# EAGLE design F2 (EAGLE 9.6.2)
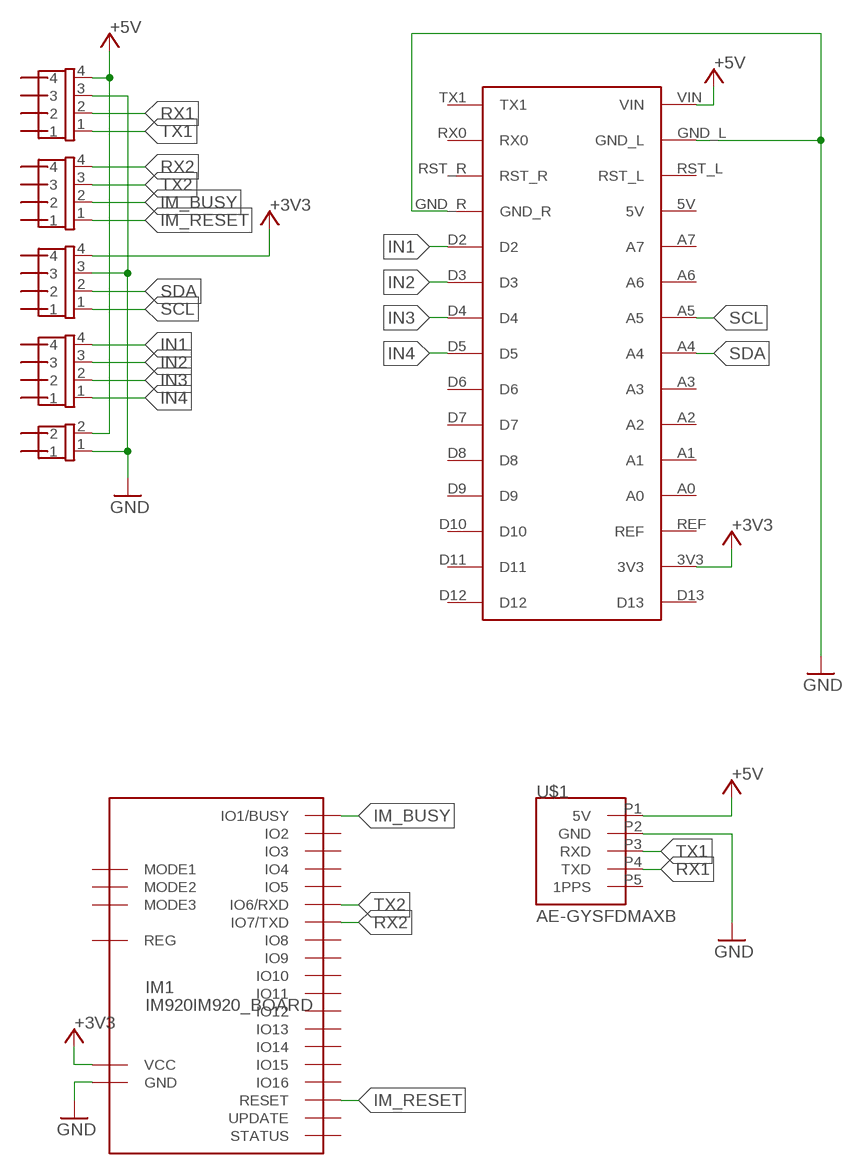
[diagram p0: schematic, sheet 1]

## Parts
ARDUINO_NANO2  ARDUINO_NANO  [ARDUINO_NANO]
CONN1  4PIN  [4PIN]
CONN2  4PIN  [4PIN]
CONN3  4PIN  [4PIN]
CONN4  4PIN  [4PIN]
CONN5  2PIN  [2PIN]
IM1  IM920IM920_BOARD  [IM920_BOARD]
U$1  AE-GYSFDMAXB  [AE-GYSFDMAXB]

## Nets
+3V3: ARDUINO_NANO2.3V3 CONN3.4 IM1.IO23(VCC)
+5V: ARDUINO_NANO2.VIN CONN1.4 CONN5.2 U$1.P1(5V)
GND: ARDUINO_NANO2.GND_L ARDUINO_NANO2.GND_R CONN1.3 CONN3.3 CONN5.1 IM1.IO24(GND) U$1.P2(GND)
IM_BUSY: CONN2.2 IM1.IO1(IO1/BUSY)
IM_RESET: CONN2.1 IM1.IO25(RESET)
IN1: ARDUINO_NANO2.D2 CONN4.4
IN2: ARDUINO_NANO2.D3 CONN4.3
IN3: ARDUINO_NANO2.D4 CONN4.2
IN4: ARDUINO_NANO2.D5 CONN4.1
RX1: CONN1.2 U$1.P4(TXD)
RX2: CONN2.4 IM1.IO7(IO7/TXD)
SCL: ARDUINO_NANO2.A5 CONN3.1
SDA: ARDUINO_NANO2.A4 CONN3.2
TX1: CONN1.1 U$1.P3(RXD)
TX2: CONN2.3 IM1.IO6(IO6/RXD)
Unconnected: ARDUINO_NANO2.5V ARDUINO_NANO2.A0 ARDUINO_NANO2.A1 ARDUINO_NANO2.A2 ARDUINO_NANO2.A3 ARDUINO_NANO2.A6 ARDUINO_NANO2.A7 ARDUINO_NANO2.D6 ARDUINO_NANO2.D7 ARDUINO_NANO2.D8 ARDUINO_NANO2.D9 ARDUINO_NANO2.D10 ARDUINO_NANO2.D11 ARDUINO_NANO2.D12 ARDUINO_NANO2.D13 ARDUINO_NANO2.REF ARDUINO_NANO2.RST_L ARDUINO_NANO2.RST_R ARDUINO_NANO2.RX0 ARDUINO_NANO2.TX1 IM1.IO2 IM1.IO3 IM1.IO4 IM1.IO5 IM1.IO8 IM1.IO9 IM1.IO10 IM1.IO11 IM1.IO12 IM1.IO13 IM1.IO14 IM1.IO15 IM1.IO16 IM1.IO17(MODE1) IM1.IO18(MODE2) IM1.IO19(MODE3) IM1.IO20(UPDATE) IM1.IO21(STATUS) IM1.IO22(REG) U$1.P5(1PPS)

## Library data of the parts
ARDUINO_NANO2 = arduino nano:ARDUINO_NANO
CONN1-CONN4 = 171822 connecter:4PIN
CONN5 = 171822 connecter:2PIN
IM1 = IM920:IM920
U$1 = AE-GYSFDMAXB:AE-GYSFDMAXB

## Board
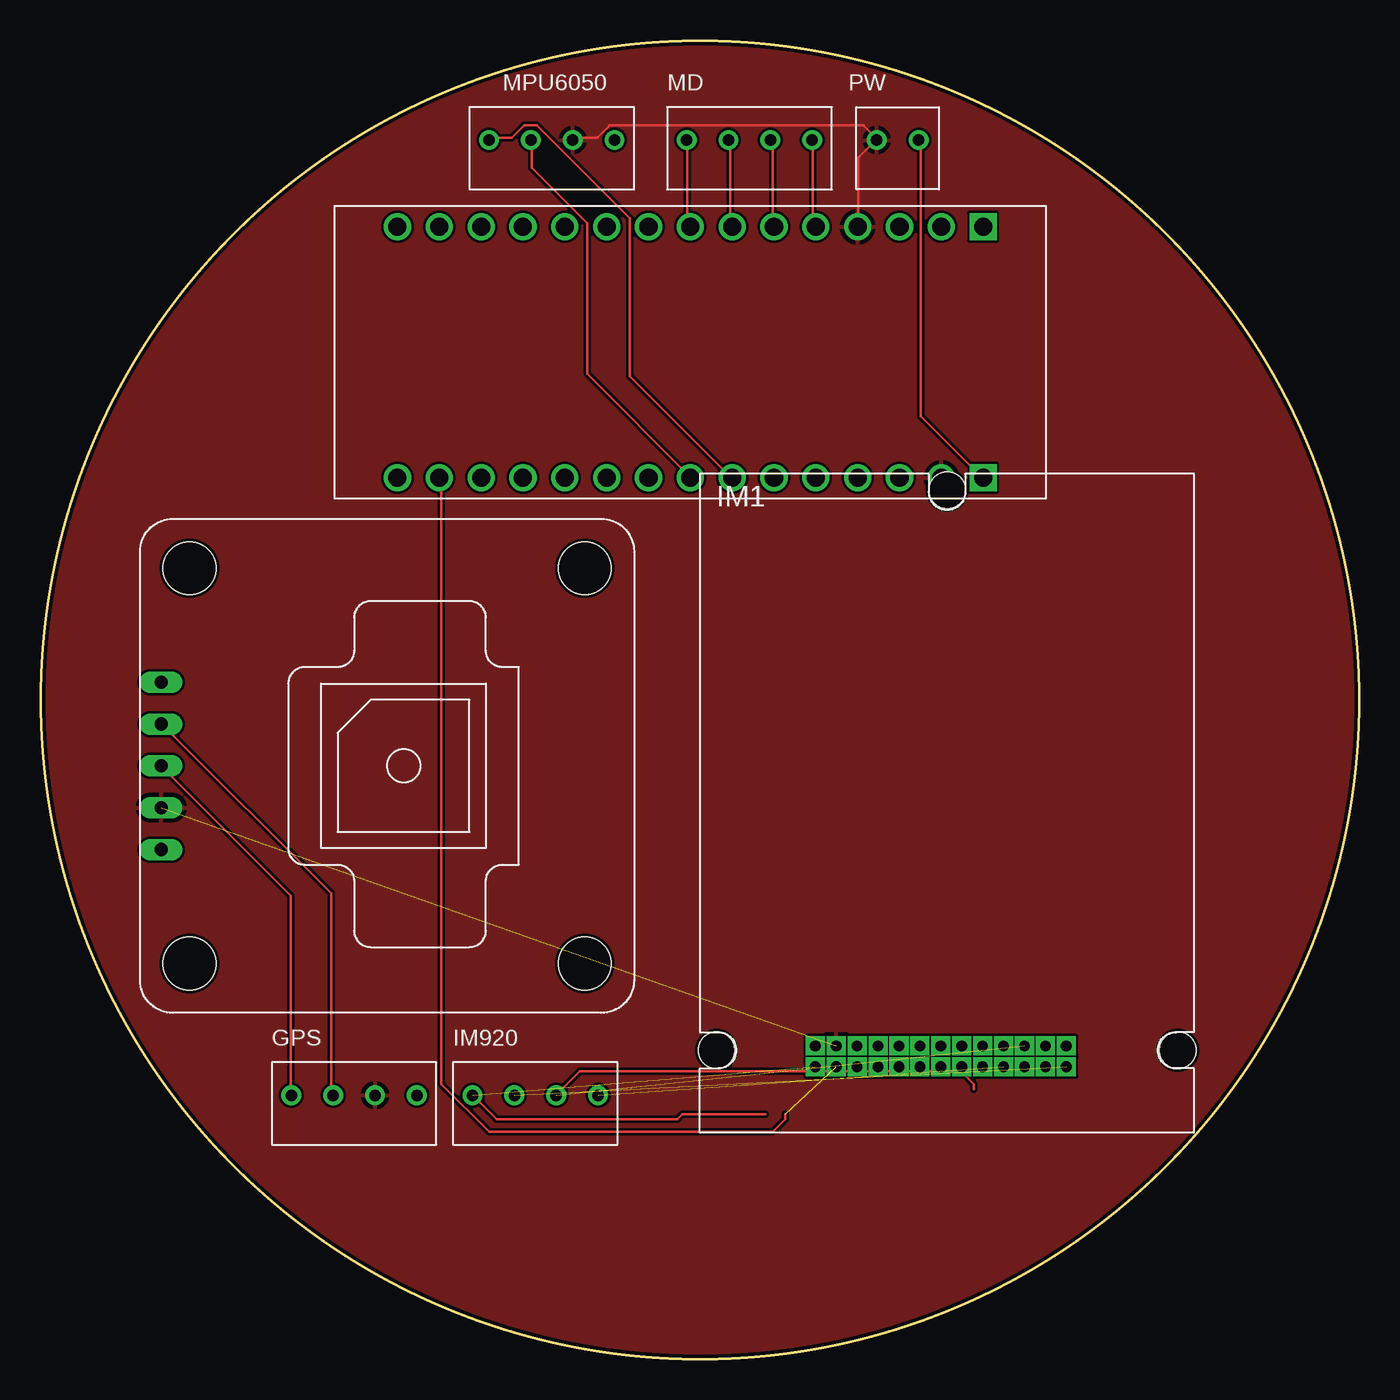
[diagram p1: board, top side]
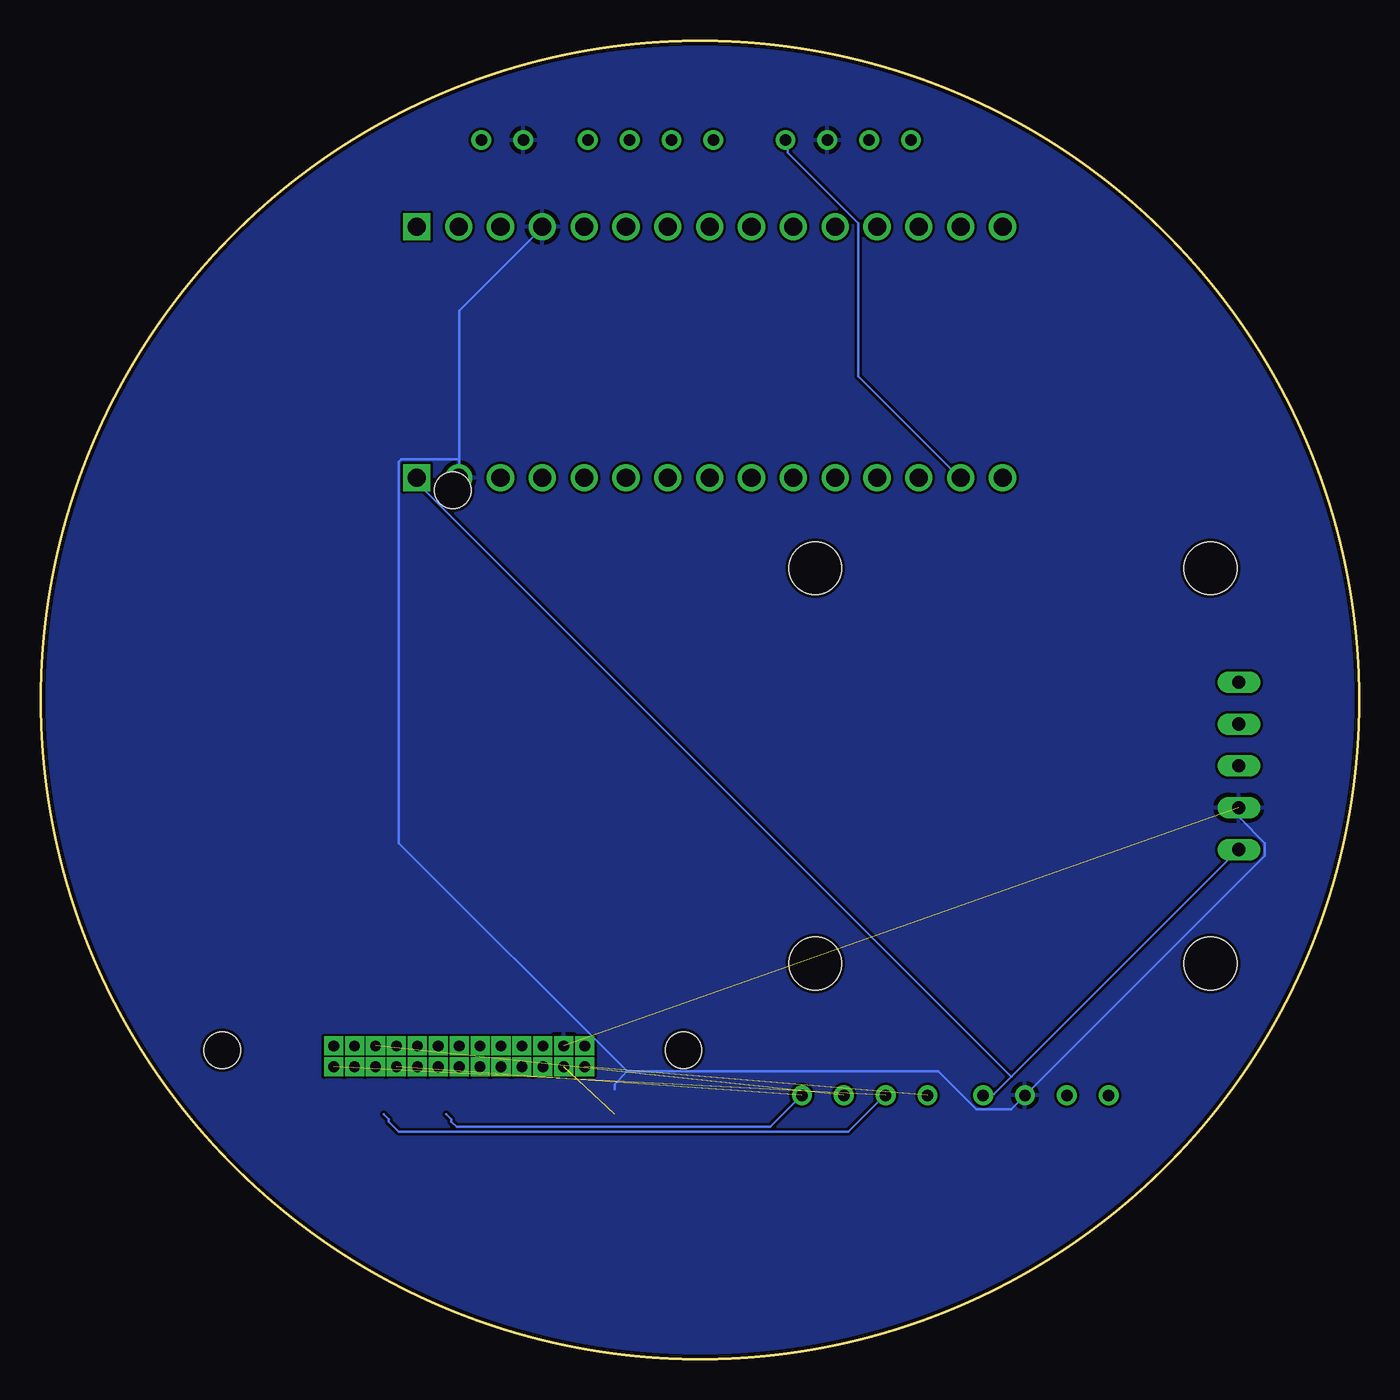
[diagram p2: board, bottom side, seen from below]

Size 80 x 80 mm. Coordinates in mm from the lower left corner, seen from the top.
Outline: circle at 40,40 radius 40
Copper layers (1*16): Top 0.035mm / dielectric 1.5mm / Bottom 0.035mm
Design rules "PCBGoGo": minimum track width 6mil, minimum drill 0.2mm, track to track 6mil, track to pad 6mil, pad to pad 6mil, via to via 6mil, smd to smd 6mil, copper to edge 0.2mm, drill to drill 6mil, minimum pad ring 10mil, minimum via ring 8mil, stop-mask expansion 4mil, vias tented up to drill 0mil, thermal gap 10mil

### Footprints (pad centres in the part's own frame; a part is rotated, then mirrored left to right if it is on the bottom)
ARDUINO_NANO = drill 1.1: 3V3 16.51,-36.83; 5V 16.51,-11.43; A0 16.51,-31.75; A1 16.51,-29.21; A2 16.51,-26.67; A3 16.51,-24.13; A4 16.51,-21.59; A5 16.51,-19.05; A6 16.51,-16.51; A7 16.51,-13.97; D2 1.27,-13.97; D3 1.27,-16.51; D4 1.27,-19.05; D5 1.27,-21.59; D6 1.27,-24.13; D7 1.27,-26.67; D8 1.27,-29.21; D9 1.27,-31.75; D10 1.27,-34.29; D11 1.27,-36.83; D12 1.27,-39.37; D13 16.51,-39.37; GND_L 16.51,-6.35; GND_R 1.27,-11.43; REF 16.51,-34.29; RST_L 16.51,-8.89; RST_R 1.27,-8.89; RX0 1.27,-6.35 | drill 1.1 square: TX1 1.27,-3.81; VIN 16.51,-3.81
4PIN = drill 0.7: 1 -3.81,0; 2 -1.27,0; 3 1.27,0; 4 3.81,0
2PIN = drill 0.7: 1 -1.27,0; 2 1.27,0
IM920_BOARD = drill 0.65 pad 0.813 square: IO1 7.24,-17.27; IO2 7.24,-16; IO3 5.97,-17.27; IO4 5.97,-16; IO5 4.7,-17.27; IO6 4.7,-16; IO7 3.43,-17.27; IO8 3.43,-16; IO9 2.16,-17.27; IO10 2.16,-16; IO11 0.89,-17.27; IO12 0.89,-16; IO13 -0.38,-17.27; IO14 -0.38,-16; IO15 -1.65,-17.27; IO16 -1.65,-16; IO17 -2.92,-17.27; IO18 -2.92,-16; IO19 -4.19,-17.27; IO20 -4.19,-16; IO21 -5.46,-17.27; IO22 -5.46,-16; IO23 -6.73,-17.27; IO24 -6.73,-16; IO25 -8,-17.27; IO26 -8,-16 | hole 2.2: -14,-16.27; 14,-16.27; 0,17.73
AE-GYSFDMAXB = drill 0.8 long: P1 13.716,5.08; P2 13.716,2.54; P3 13.716,0; P4 13.716,-2.54; P5 13.716,-5.08 | hole 3.2: -12,12; 12,12; 12,-12; -12,-12

### Placement (x,y rotation side)
ARDUINO_NANO2  61,70 270 top
CONN1  19,16 0 top
CONN2  30,16 0 top
CONN3  31,74 0 top
CONN4  43,74 0 top
CONN5  52,74 0 top
IM1  55,35 0 top
U$1  21,36 180 top

### Tracks (layer width: path | path; a pad name or v marks a point on that pad's centre or on a via)
+3V3  (1 unrouted)
  Top 0.152: 45.18,14.85 45.18,14.55 44.42,13.79 27.2,13.79 24.3,16.68 24.3,53.41 ARDUINO_NANO2.3V3
  Bottom 0.152: CONN3.4 34.67,73.98 34.67,73.22 30.4,68.96 30.4,59.66 24.3,53.56 ARDUINO_NANO2.3V3
+5V
  Top 0.152: CONN5.2 53.41,73.98 53.41,57.22 57.07,53.56 ARDUINO_NANO2.VIN
  Bottom 0.152: 21.1,17.14 7.39,30.86 U$1.P1 | 21.1,17.14 22.17,16.07 22.78,16.07 CONN1.4 | 21.1,17.14 57.07,53.11 57.07,53.41 ARDUINO_NANO2.VIN
GND  (1 unrouted)
  Top 0.152: CONN3.3 32.38,74.14 33.75,74.14 34.51,74.9 49.91,74.9 50.67,74.14 CONN5.1 50.67,73.98 49.6,72.92 49.6,68.8 ARDUINO_NANO2.GND_R
  Bottom 0.152: 54.63,54.63 54.63,63.62 49.6,68.65 ARDUINO_NANO2.GND_R | 54.63,54.63 54.63,53.56 ARDUINO_NANO2.GND_L | 45.18,16.38 45.18,16.68 44.42,17.45 | 44.42,17.45 25.52,17.45 23.24,15.16 21.1,15.16 20.34,15.92 CONN1.3 20.19,16.07 5.71,30.55 5.71,31.31 7.23,32.84 7.23,33.45 U$1.P2 | 54.63,54.63 58.14,54.63 58.29,54.48 58.29,31.31 44.42,17.45
  pour Top: -10,85 85,85 85,-15 -10,-15
  pour Bottom: -10,90 85,90 85,-15 -10,-15
IM_BUSY  (1 unrouted)
  Bottom 0.152: 59.2,14.85 58.9,14.55 58.9,14.4 58.29,13.79 31.01,13.79 28.88,15.92 CONN2.2
IM_RESET  (1 unrouted)
  Top 0.152: 43.96,14.85 38.93,14.85 38.63,14.55 27.66,14.55 26.28,15.92 CONN2.1
IN1
  Top 0.152: CONN4.4 46.86,73.98 46.86,68.96 47.01,68.8 ARDUINO_NANO2.D2
IN2
  Top 0.152: CONN4.3 44.42,73.98 44.42,68.8 ARDUINO_NANO2.D3
IN3
  Top 0.152: CONN4.2 41.83,73.98 41.83,68.8 ARDUINO_NANO2.D4
IN4
  Top 0.152: CONN4.1 39.24,73.98 39.24,68.96 39.39,68.8 ARDUINO_NANO2.D5
RX1
  Top 0.152: CONN1.2 17.6,16.07 17.6,28.27 7.39,38.48 U$1.P4
RX2  (1 unrouted)
  Bottom 0.152: 55.39,14.85 55.09,14.55 55.09,14.4 54.78,14.09 35.73,14.09 33.9,15.92 CONN2.4
SCL
  Top 0.152: CONN3.1 27.2,74.14 28.57,74.14 29.33,74.9 30.09,74.9 35.73,69.26 35.73,59.66 41.83,53.56 ARDUINO_NANO2.A5
SDA
  Top 0.152: CONN3.2 29.79,73.98 29.79,72.31 33.14,68.96 33.14,59.81 39.39,53.56 ARDUINO_NANO2.A4
TX1
  Top 0.152: CONN1.1 15.16,16.07 15.16,28.11 7.39,35.88 U$1.P3
TX2  (1 unrouted)
  Top 0.152: 56.61,16.38 56.61,16.68 55.85,17.45 32.69,17.45 31.31,16.07 CONN2.3

### Text on the board
tPlace: MPU6050 | MD | PW | GPS | IM920